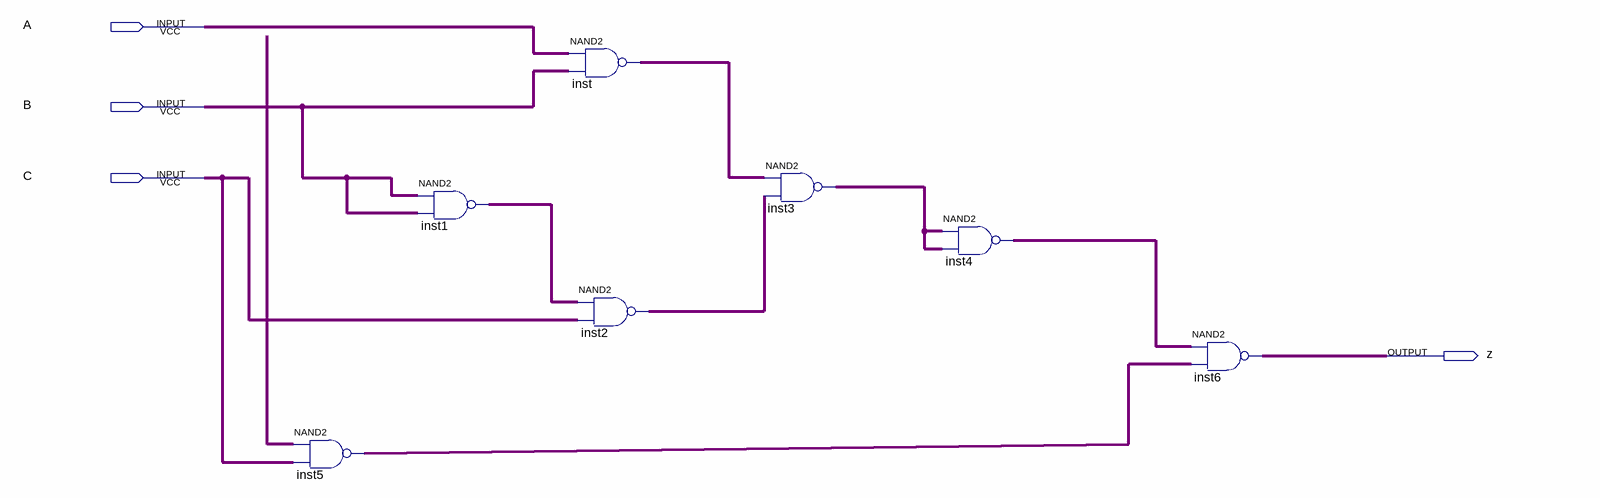
[diagram p0: schematic sheet]
// Quartus schematic Block1.bdf as structural Verilog: 7 symbols, 4 pins
module Block1 (
  input  A,
  input  B,
  input  C,
  output z
);

  wire inst1_out, inst2_out, inst3_out, inst4_out, inst5_out, inst_out, undriven;

  nand inst5 (inst5_out, undriven, C);
  nand inst1 (inst1_out, B, B);
  nand inst (inst_out, A, B);
  nand inst2 (inst2_out, inst1_out, C);
  nand inst3 (inst3_out, inst_out, inst2_out);
  nand inst4 (inst4_out, inst3_out, inst3_out);
  nand inst6 (z, inst4_out, inst5_out);
endmodule
